# Altium project RF_module_Project.PrjPcb
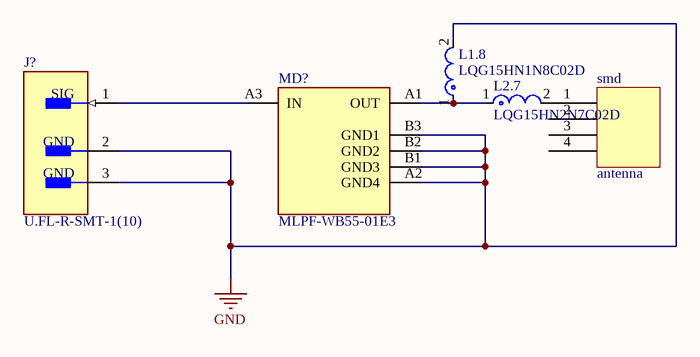
[diagram p0: Rf schematic.SchDoc]
1 sheet, 5 parts. Net scope: global (net labels, ports and power ports of the same name join across sheets).
Board file: PCB1.PcbDoc

## Sheet Rf schematic.SchDoc
size A; SheetNumber: 1; SheetTotal: 1

### Parts
J1  U.FL-R-SMT-1(10)  [FP-U_FL-R-SMT-1_10-MFG]
L1.8  LQG15HN1N8C02D  [FP-LQG15HH_02-IPC_A]
L2.7  LQG15HN2N7C02D  [FP-LQG15HH_02-IPC_B]
MD?  MLPF-WB55-01E3  [FP-MLPF-WB55-01E3-MFG]
smd  antenna  [ANT_JOHANSON_2450AT43B100E]

### Nets
GND: J1.2(GND) J1.3(GND) L1.8.2 MD?.A2(GND4) MD?.B1(GND3) MD?.B2(GND2) MD?.B3(GND1)
NetJ1_1: J1.1(SIG) MD?.A3(IN)
NetL1.8_1: L1.8.1 L2.7.1 MD?.A1(OUT)

Not connected (* = marked no-connect by the designer): L2.7 2; smd 1(0) 2 3 4

### Library data of the parts
J1 = CMP-2000-05152-3: CONN U.FL RCPT STR 50 OHM SMD; Max Frequency: 6GHz; Connector Type: Coaxial; Body Plating: Silver; Body Material: Bronze; Impedance: 50R; Dielectric Material: Polymer; Insulation Resistance: 500MR; Gender: Male; Packaging: Cut Tape; Length: 3mm; Package Quantity: 2500; Termination: Solder; Lead Free: Lead Free; Series: U.FL; Min Operating Temperature: -40°C; Fastening Type: Snap; Contact Material: Brass; Orientation: Straight; Wire/Cable Type: Coaxial; Frequency: 6GHz; Contact Plating: Gold; Depth: 3.1mm; Weight: 0.001764oz; Max Operating Temperature: 90°C; Radiation Hardening: No; REACH SVHC: No SVHC; Mount: Surface Mount; Housing Color: Beige
L1.8 = CMP-06042-004125-1: Multilayer type RF Inductor 1.8nH ±0.2nH 0.08Ω 900mA 0402; DC Resistance (DCR): 80mR; Test Frequency: 100MHz; Core Material: Air; Self Resonant Frequency: 6GHz; Shielding: Unshielded; Mount: Surface Mount; Min Operating Temperature: -55°C; Packaging: Cut Tape; Max Operating Temperature: 125°C; Case/Package: 0402; Inductance: 1.8nH; Current Rating: 900mA; Case Code (Metric): 1005; Case Code (Imperial): 0402
L2.7 = CMP-06042-003573-1: Multilayer type RF Inductor 2.7nH ±0.2nH 0.1Ω 800mA 0402; Core Material: Air; DC Resistance (DCR): 100mR; Shielding: Unshielded; Test Frequency: 100MHz; Self Resonant Frequency: 6GHz; Min Operating Temperature: -55°C; Case Code (Imperial): 0402; Mount: Surface Mount; Current Rating: 800mA; Case Code (Metric): 1005; Inductance: 2.7nH; Case/Package: 0402; Max Operating Temperature: 125°C; Packaging: Tape and Reel
MD? = CMP-12074-000002-1: RF FILTER LOW PASS 2.45GHZ 6SMD
smd = Component_1